# Altium schematic sheet Sheet1.SchDoc
size A0
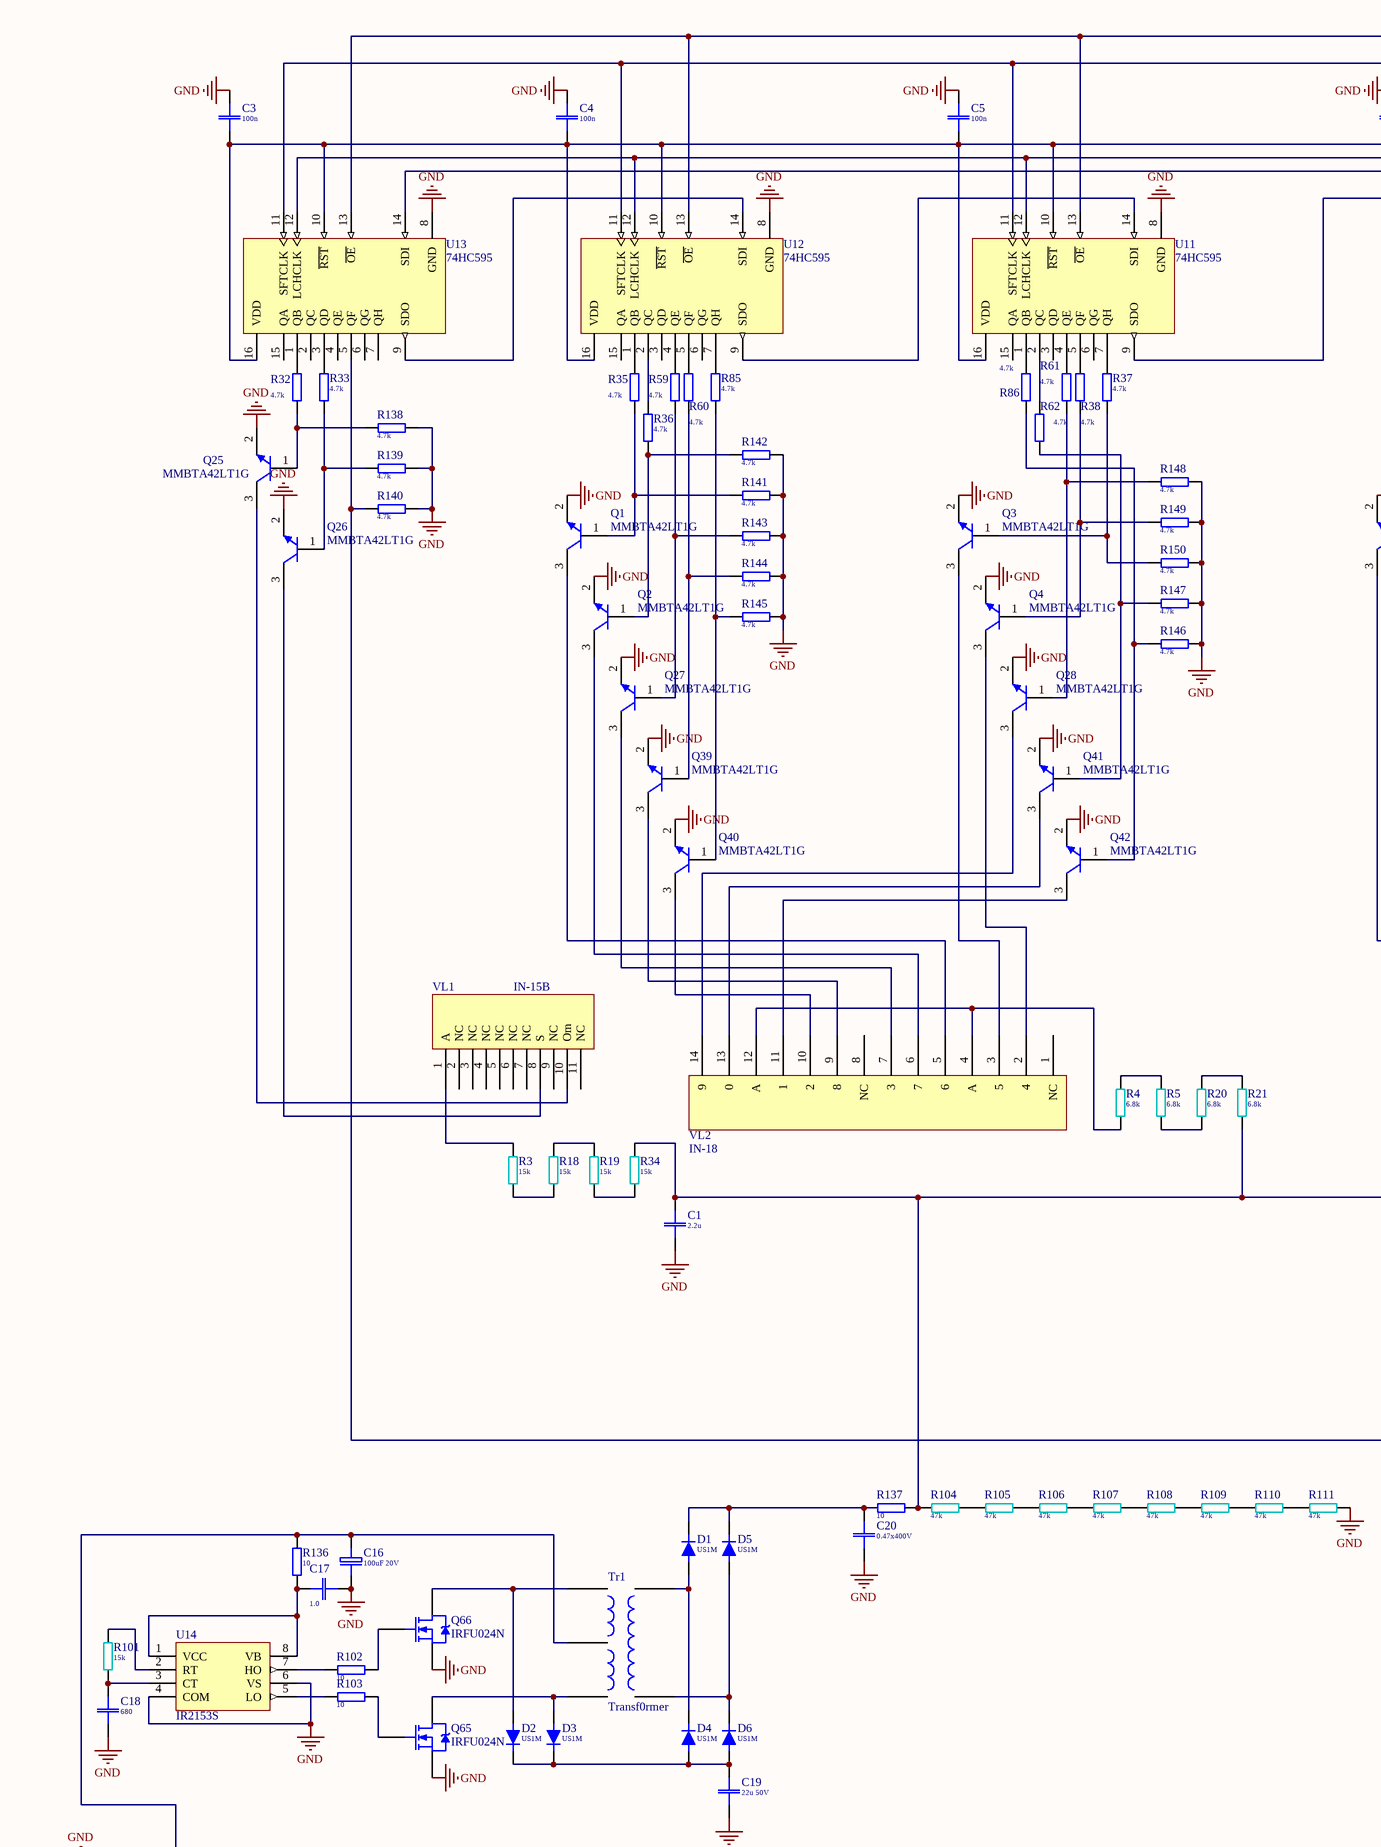
[diagram p0: Sheet1.SchDoc, top left]
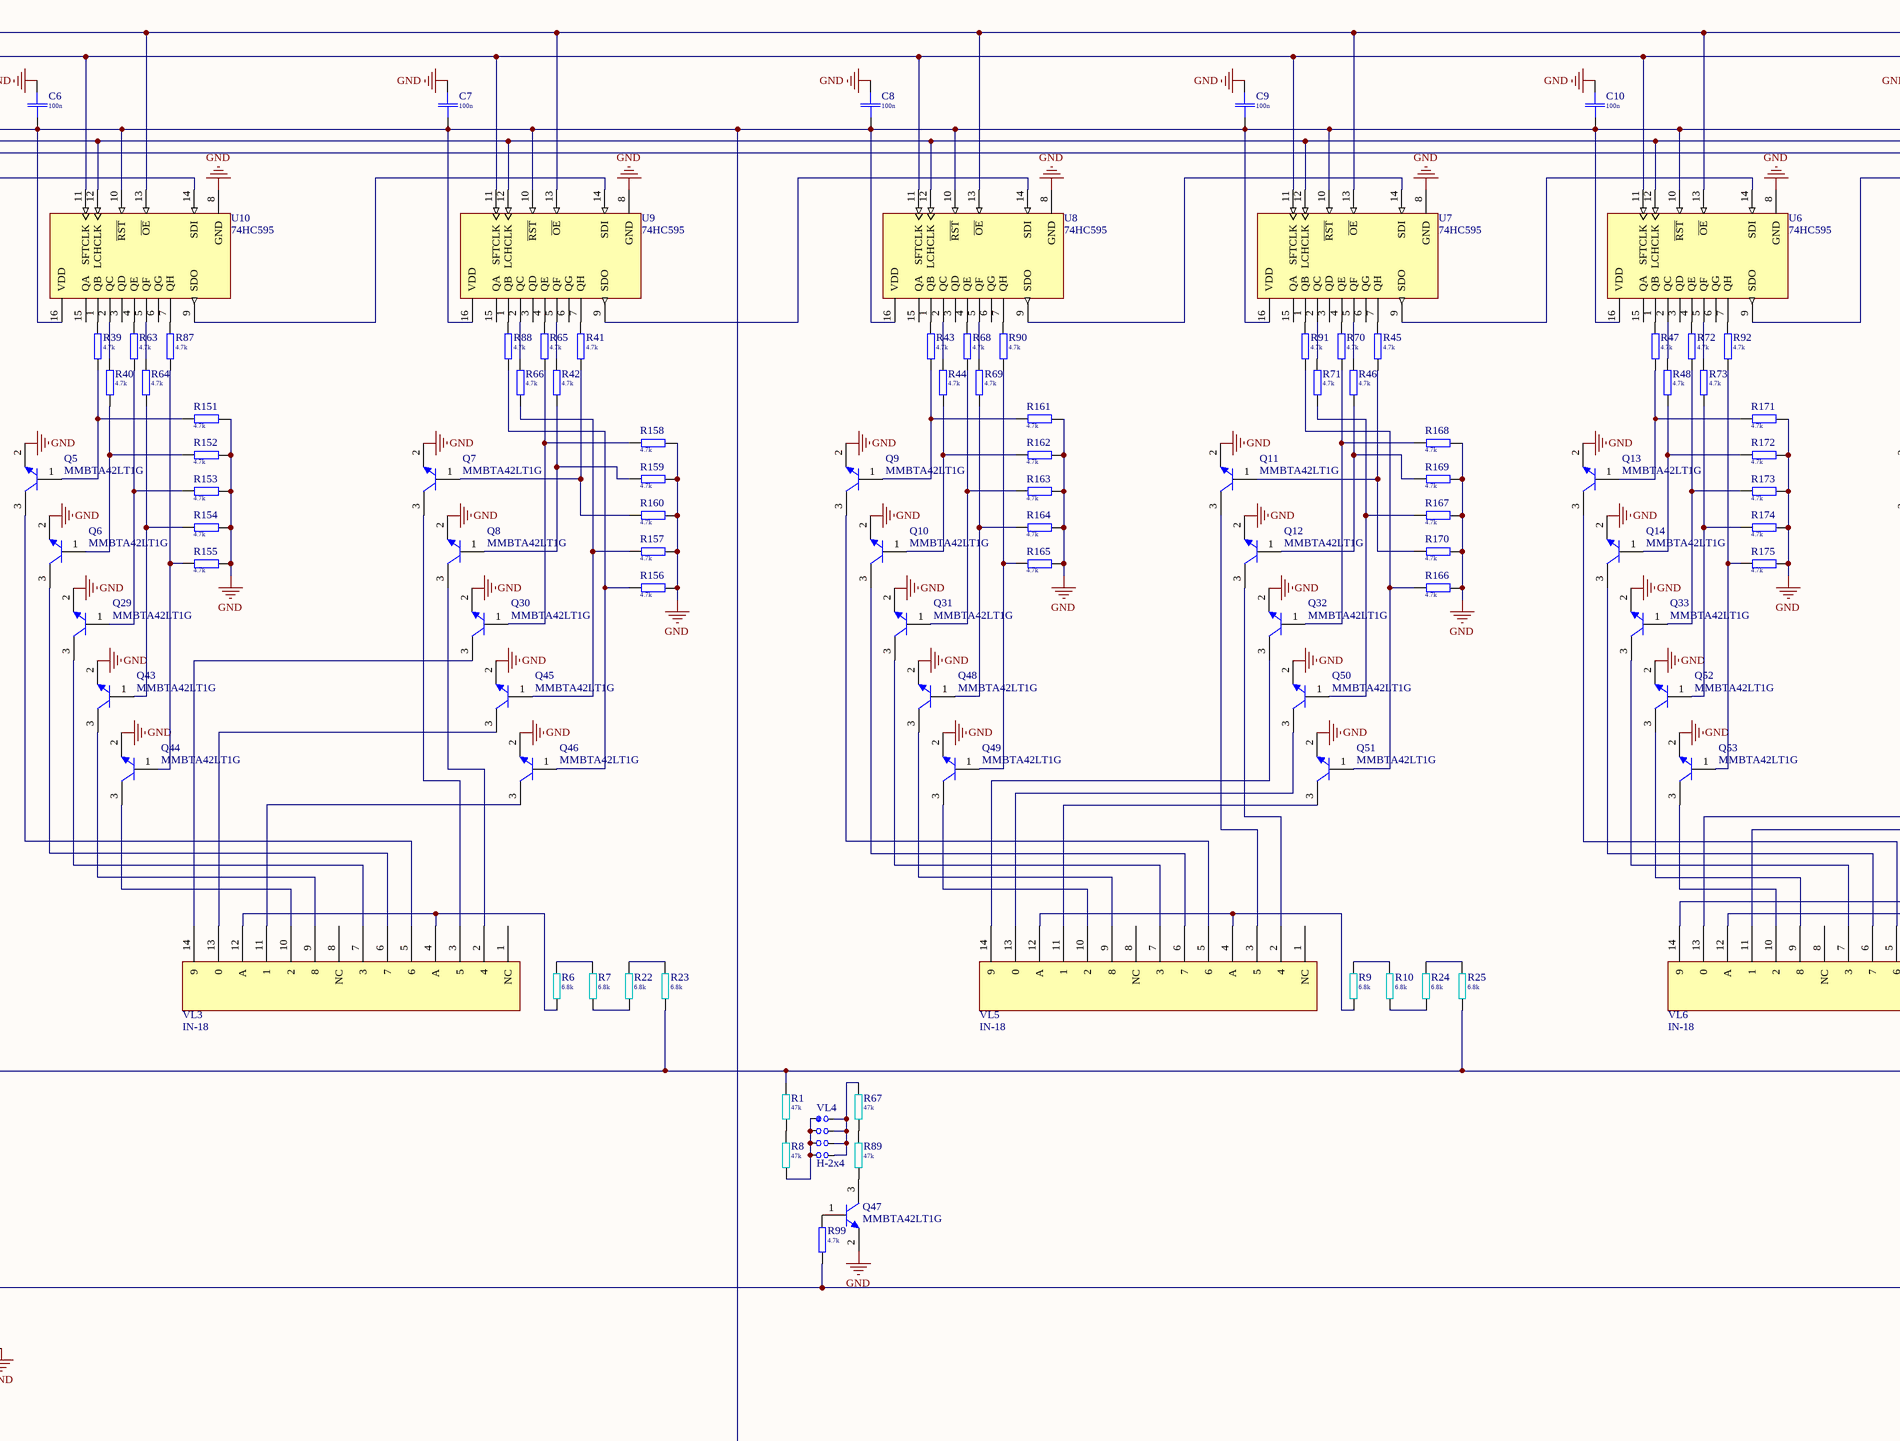
[diagram p1: Sheet1.SchDoc, top middle]
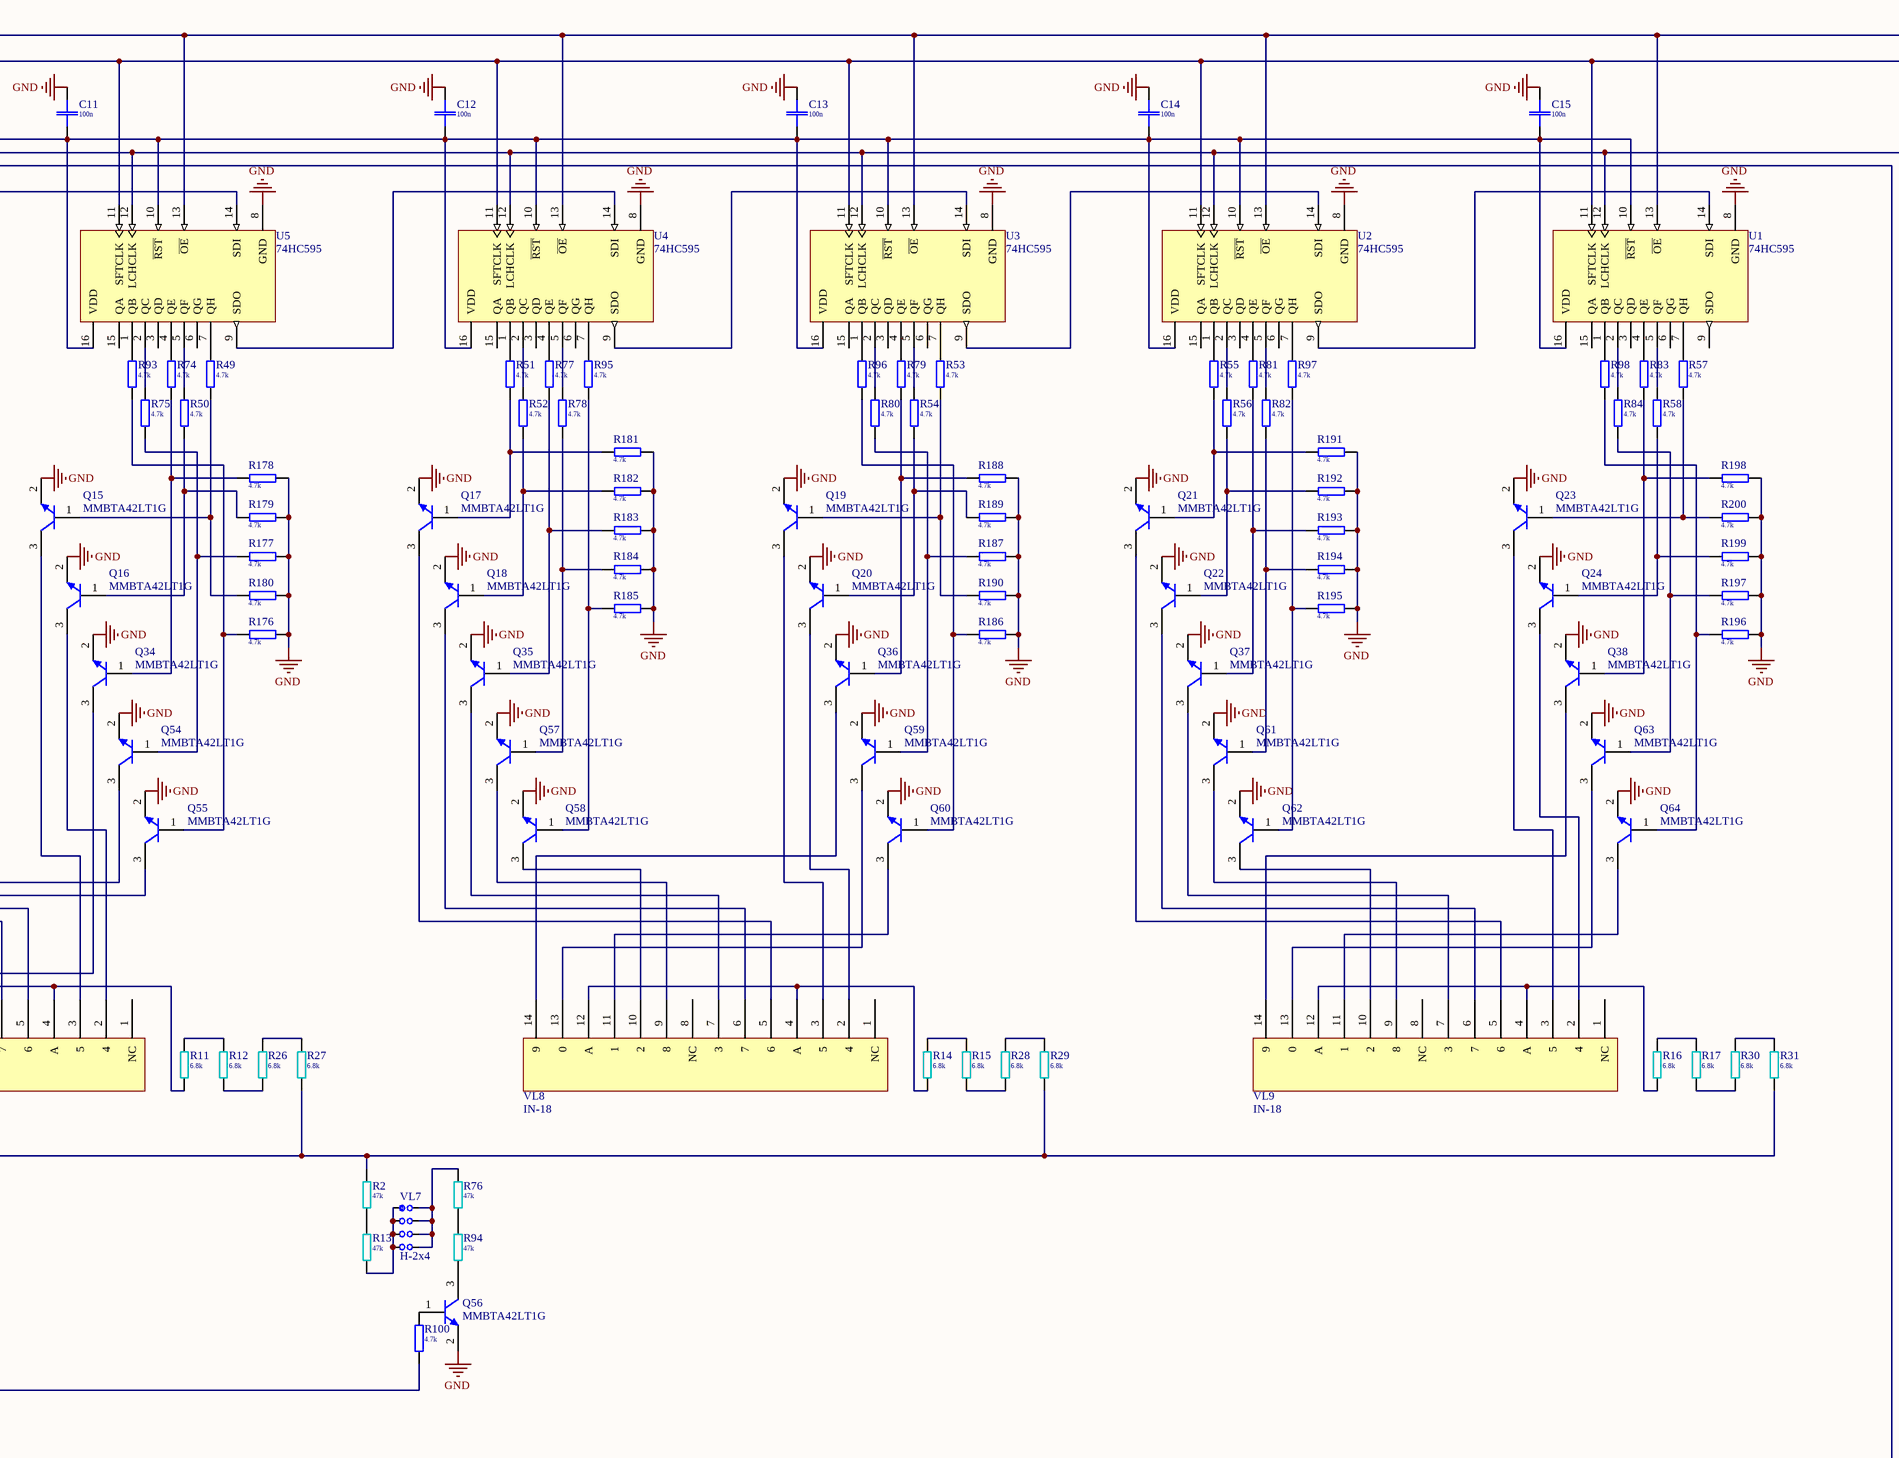
[diagram p2: Sheet1.SchDoc, top right]
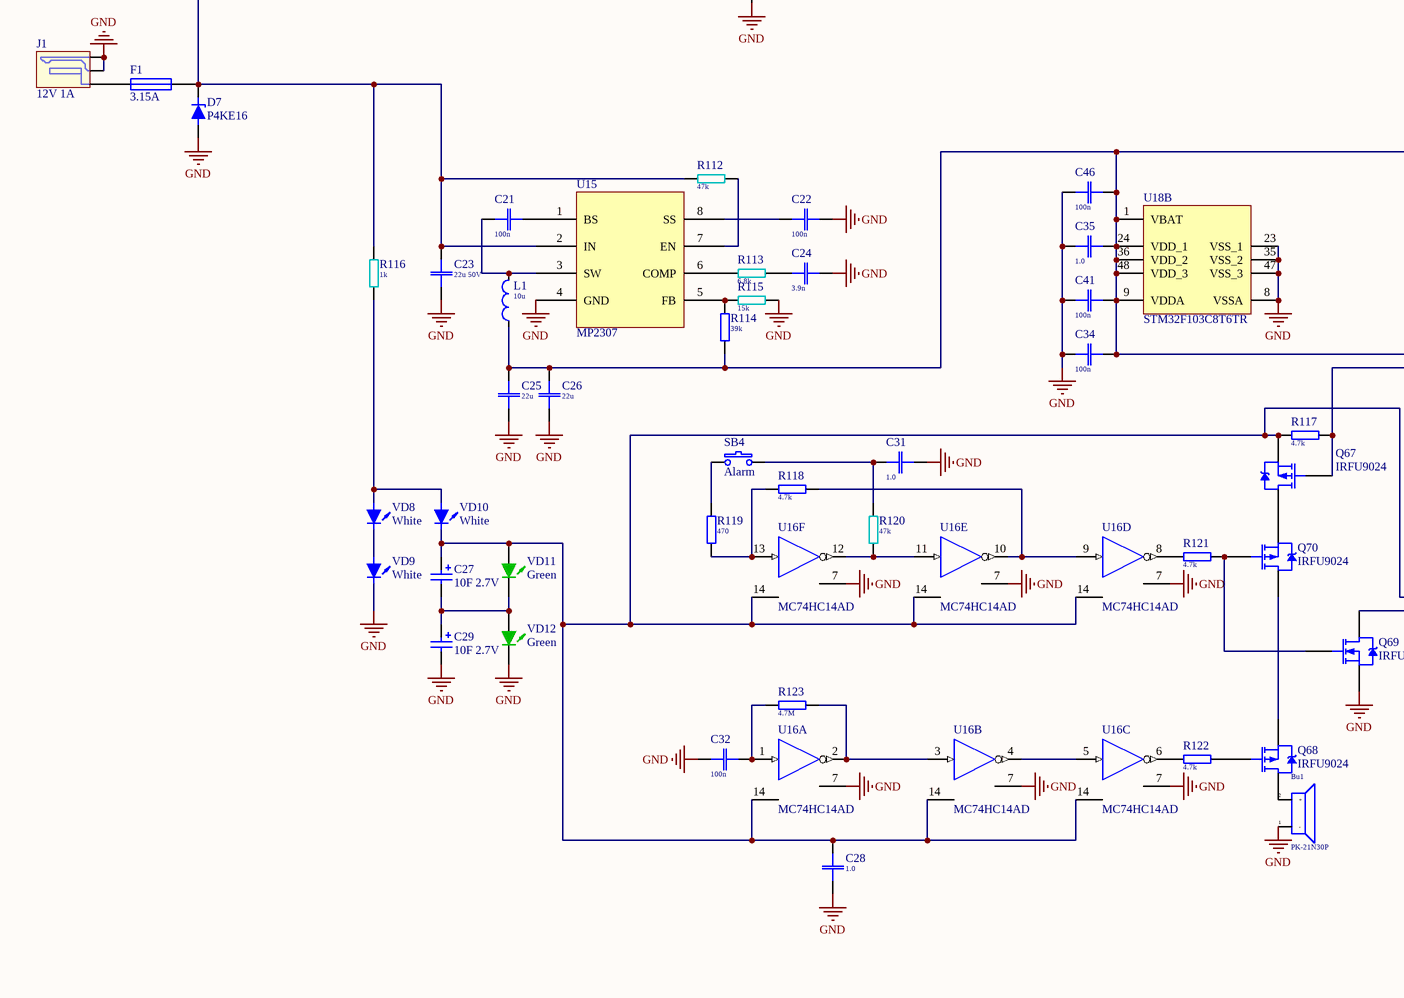
[diagram p3: Sheet1.SchDoc, bottom left]
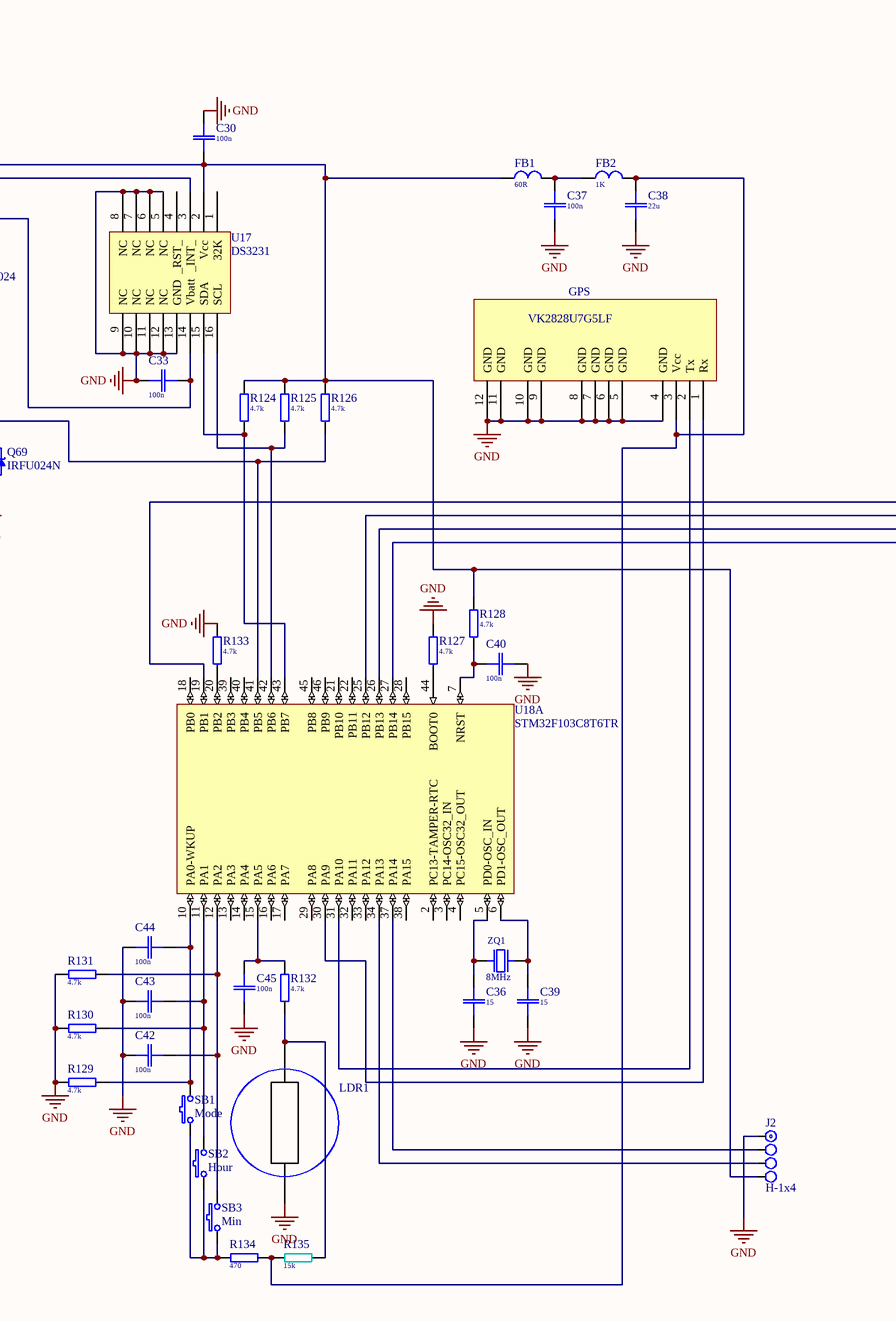
[diagram p4: Sheet1.SchDoc, bottom middle]

## Parts
Bu1  PK-21N30P  [Buzzer]
C1  2.2u  [CBB22]
C3  100n  [C0805(2013)]
C4  100n  [C0805(2013)]
C5  100n  [C0805(2013)]
C6  100n  [C0805(2013)]
C7  100n  [C0805(2013)]
C8  100n  [C0805(2013)]
C9  100n  [C0805(2013)]
C10  100n  [C0805(2013)]
C11  100n  [C0805(2013)]
C12  100n  [C0805(2013)]
C13  100n  [C0805(2013)]
C14  100n  [C0805(2013)]
C15  100n  [C0805(2013)]
C16  100uF 20V  [100.0x20V pol]
C17  1.0  [C0805(2013)]
C18  680  [C0805(2013)]
C19  22u 50V  [C1210(3225)]
C20  value 0.47x400V  [MKP 18x7 h14 R15.24]  (hidden comment: 3,3u)
C21  100n  [C0805(2013)]
C22  100n  [C0805(2013)]
C23  22u 50V  [C1210(3225)]
C24  3.9n  [C0805(2013)]
C25  22u  [C1210(3225)]
C26  22u  [C1210(3225)]
C27  value 10F 2.7V  [10F2.7V]  (hidden comment: Cap Pol2)
C28  1.0  [C0805(2013)]
C29  value 10F 2.7V  [10F2.7V]  (hidden comment: Cap Pol2)
C30  100n  [C0805(2013)]
C31  1.0  [C0805(2013)]
C32  100n  [C0805(2013)]
C33  100n  [C0805(2013)]
C34  100n  [C0805(2013)]
C35  1.0  [C0805(2013)]
C36  15  [C0805(2013)]
C37  100n  [C0805(2013)]
C38  22u  [C1210(3225)]
C39  15  [C0805(2013)]
C40  100n  [C0805(2013)]
C41  100n  [C0805(2013)]
C42  100n  [C0805(2013)]
C43  100n  [C0805(2013)]
C44  100n  [C0805(2013)]
C45  100n  [C0805(2013)]
C46  100n  [C0805(2013)]
D1  US1M  [DO-214AC (SMA)]
D2  US1M  [DO-214AC (SMA)]
D3  US1M  [DO-214AC (SMA)]
D4  US1M  [DO-214AC (SMA)]
D5  US1M  [DO-214AC (SMA)]
D6  US1M  [DO-214AC (SMA)]
D7  P4KE16  [DO-15-400]
F1  3.15A  [PIN-W2/E2.8]
FB1  60R  [C1206]
FB2  1K  [C1206]
GPS  VK2828U7G5LF  [GPSmodule]
J1  12V 1A  [Power-Jack]
J2  H-1x4  [J1x4]
L1  10u  [Dr-SD-75]
LDR1  LDR  [CAPPR250-630X1120]  (value not drawn)
Q1  MMBTA42LT1G  [ONSC-SOT-23-3-318-08_V]
Q2  MMBTA42LT1G  [ONSC-SOT-23-3-318-08_V]
Q3  MMBTA42LT1G  [ONSC-SOT-23-3-318-08_V]
Q4  MMBTA42LT1G  [ONSC-SOT-23-3-318-08_V]
Q5  MMBTA42LT1G  [ONSC-SOT-23-3-318-08_V]
Q6  MMBTA42LT1G  [ONSC-SOT-23-3-318-08_V]
Q7  MMBTA42LT1G  [ONSC-SOT-23-3-318-08_V]
Q8  MMBTA42LT1G  [ONSC-SOT-23-3-318-08_V]
Q9  MMBTA42LT1G  [ONSC-SOT-23-3-318-08_V]
Q10  MMBTA42LT1G  [ONSC-SOT-23-3-318-08_V]
Q11  MMBTA42LT1G  [ONSC-SOT-23-3-318-08_V]
Q12  MMBTA42LT1G  [ONSC-SOT-23-3-318-08_V]
Q13  MMBTA42LT1G  [ONSC-SOT-23-3-318-08_V]
Q14  MMBTA42LT1G  [ONSC-SOT-23-3-318-08_V]
Q15  MMBTA42LT1G  [ONSC-SOT-23-3-318-08_V]
Q16  MMBTA42LT1G  [ONSC-SOT-23-3-318-08_V]
Q17  MMBTA42LT1G  [ONSC-SOT-23-3-318-08_V]
Q18  MMBTA42LT1G  [ONSC-SOT-23-3-318-08_V]
Q19  MMBTA42LT1G  [ONSC-SOT-23-3-318-08_V]
Q20  MMBTA42LT1G  [ONSC-SOT-23-3-318-08_V]
Q21  MMBTA42LT1G  [ONSC-SOT-23-3-318-08_V]
Q22  MMBTA42LT1G  [ONSC-SOT-23-3-318-08_V]
Q23  MMBTA42LT1G  [ONSC-SOT-23-3-318-08_V]
Q24  MMBTA42LT1G  [ONSC-SOT-23-3-318-08_V]
Q25  MMBTA42LT1G  [ONSC-SOT-23-3-318-08_V]
Q26  MMBTA42LT1G  [ONSC-SOT-23-3-318-08_V]
Q27  MMBTA42LT1G  [ONSC-SOT-23-3-318-08_V]
Q28  MMBTA42LT1G  [ONSC-SOT-23-3-318-08_V]
Q29  MMBTA42LT1G  [ONSC-SOT-23-3-318-08_V]
Q30  MMBTA42LT1G  [ONSC-SOT-23-3-318-08_V]
Q31  MMBTA42LT1G  [ONSC-SOT-23-3-318-08_V]
Q32  MMBTA42LT1G  [ONSC-SOT-23-3-318-08_V]
Q33  MMBTA42LT1G  [ONSC-SOT-23-3-318-08_V]
Q34  MMBTA42LT1G  [ONSC-SOT-23-3-318-08_V]
Q35  MMBTA42LT1G  [ONSC-SOT-23-3-318-08_V]
Q36  MMBTA42LT1G  [ONSC-SOT-23-3-318-08_V]
Q37  MMBTA42LT1G  [ONSC-SOT-23-3-318-08_V]
Q38  MMBTA42LT1G  [ONSC-SOT-23-3-318-08_V]
Q39  MMBTA42LT1G  [ONSC-SOT-23-3-318-08_V]
Q40  MMBTA42LT1G  [ONSC-SOT-23-3-318-08_V]
Q41  MMBTA42LT1G  [ONSC-SOT-23-3-318-08_V]
Q42  MMBTA42LT1G  [ONSC-SOT-23-3-318-08_V]
Q43  MMBTA42LT1G  [ONSC-SOT-23-3-318-08_V]
Q44  MMBTA42LT1G  [ONSC-SOT-23-3-318-08_V]
Q45  MMBTA42LT1G  [ONSC-SOT-23-3-318-08_V]
Q46  MMBTA42LT1G  [ONSC-SOT-23-3-318-08_V]
Q47  MMBTA42LT1G  [ONSC-SOT-23-3-318-08_V]
Q48  MMBTA42LT1G  [ONSC-SOT-23-3-318-08_V]
Q49  MMBTA42LT1G  [ONSC-SOT-23-3-318-08_V]
Q50  MMBTA42LT1G  [ONSC-SOT-23-3-318-08_V]
Q51  MMBTA42LT1G  [ONSC-SOT-23-3-318-08_V]
Q52  MMBTA42LT1G  [ONSC-SOT-23-3-318-08_V]
Q53  MMBTA42LT1G  [ONSC-SOT-23-3-318-08_V]
Q54  MMBTA42LT1G  [ONSC-SOT-23-3-318-08_V]
Q55  MMBTA42LT1G  [ONSC-SOT-23-3-318-08_V]
Q56  MMBTA42LT1G  [ONSC-SOT-23-3-318-08_V]
Q57  MMBTA42LT1G  [ONSC-SOT-23-3-318-08_V]
Q58  MMBTA42LT1G  [ONSC-SOT-23-3-318-08_V]
Q59  MMBTA42LT1G  [ONSC-SOT-23-3-318-08_V]
Q60  MMBTA42LT1G  [ONSC-SOT-23-3-318-08_V]
Q61  MMBTA42LT1G  [ONSC-SOT-23-3-318-08_V]
Q62  MMBTA42LT1G  [ONSC-SOT-23-3-318-08_V]
Q63  MMBTA42LT1G  [ONSC-SOT-23-3-318-08_V]
Q64  MMBTA42LT1G  [ONSC-SOT-23-3-318-08_V]
Q65  IRFU024N  [TO-251AA]
Q66  IRFU024N  [TO-251AA]
Q67  IRFU9024  [TO-251AA]
Q68  IRFU9024  [TO-251AA]
Q69  IRFU024N  [TO-251AA]
Q70  IRFU9024  [TO-251AA]
R1  47k  [R1206]
R2  47k  [R1206]
R3  15k  [R1206]
R4  6.8k  [R1206]
R5  6.8k  [R1206]
R6  6.8k  [R1206]
R7  6.8k  [R1206]
R8  47k  [R1206]
R9  6.8k  [R1206]
R10  6.8k  [R1206]
R11  6.8k  [R1206]
R12  6.8k  [R1206]
R13  47k  [R1206]
R14  6.8k  [R1206]
R15  6.8k  [R1206]
R16  6.8k  [R1206]
R17  6.8k  [R1206]
R18  15k  [R1206]
R19  15k  [R1206]
R20  6.8k  [R1206]
R21  6.8k  [R1206]
R22  6.8k  [R1206]
R23  6.8k  [R1206]
R24  6.8k  [R1206]
R25  6.8k  [R1206]
R26  6.8k  [R1206]
R27  6.8k  [R1206]
R28  6.8k  [R1206]
R29  6.8k  [R1206]
R30  6.8k  [R1206]
R31  6.8k  [R1206]
R32  4.7k  [R0805]
R33  4.7k  [R0805]
R34  15k  [R1206]
R35  4.7k  [R0805]
R36  4.7k  [R0805]
R37  4.7k  [R0805]
R38  4.7k  [R0805]
R39  4.7k  [R0805]
R40  4.7k  [R0805]
R41  4.7k  [R0805]
R42  4.7k  [R0805]
R43  4.7k  [R0805]
R44  4.7k  [R0805]
R45  4.7k  [R0805]
R46  4.7k  [R0805]
R47  4.7k  [R0805]
R48  4.7k  [R0805]
R49  4.7k  [R0805]
R50  4.7k  [R0805]
R51  4.7k  [R0805]
R52  4.7k  [R0805]
R53  4.7k  [R0805]
R54  4.7k  [R0805]
R55  4.7k  [R0805]
R56  4.7k  [R0805]
R57  4.7k  [R0805]
R58  4.7k  [R0805]
R59  4.7k  [R0805]
R60  4.7k  [R0805]
R61  4.7k  [R0805]
R62  4.7k  [R0805]
R63  4.7k  [R0805]
R64  4.7k  [R0805]
R65  4.7k  [R0805]
R66  4.7k  [R0805]
R67  47k  [R1206]
R68  4.7k  [R0805]
R69  4.7k  [R0805]
R70  4.7k  [R0805]
R71  4.7k  [R0805]
R72  4.7k  [R0805]
R73  4.7k  [R0805]
R74  4.7k  [R0805]
R75  4.7k  [R0805]
R76  47k  [R1206]
R77  4.7k  [R0805]
R78  4.7k  [R0805]
R79  4.7k  [R0805]
R80  4.7k  [R0805]
R81  4.7k  [R0805]
R82  4.7k  [R0805]
R83  4.7k  [R0805]
R84  4.7k  [R0805]
R85  4.7k  [R0805]
R86  4.7k  [R0805]
R87  4.7k  [R0805]
R88  4.7k  [R0805]
R89  47k  [R1206]
R90  4.7k  [R0805]
R91  4.7k  [R0805]
R92  4.7k  [R0805]
R93  4.7k  [R0805]
R94  47k  [R1206]
R95  4.7k  [R0805]
R96  4.7k  [R0805]
R97  4.7k  [R0805]
R98  4.7k  [R0805]
R99  4.7k  [R0805]
R100  4.7k  [R0805]
R101  15k  [R1206]
R102  10  [R0805]
R103  10  [R0805]
R104  47k  [R1206]
R105  47k  [R1206]
R106  47k  [R1206]
R107  47k  [R1206]
R108  47k  [R1206]
R109  47k  [R1206]
R110  47k  [R1206]
R111  47k  [R1206]
R112  47k  [R1206]
R113  6.8k  [R1206]
R114  39k  [R0805]
R115  15k  [R1206]
R116  1k  [R1206]
R117  4.7k  [R0805]
R118  4.7k  [R0805]
R119  470  [R0805]
R120  47k  [R1206]
R121  4.7k  [R0805]
R122  4.7k  [R0805]
R123  4.7M  [R0805]
R124  4.7k  [R0805]
R125  4.7k  [R0805]
R126  4.7k  [R0805]
R127  4.7k  [R0805]
R128  4.7k  [R0805]
R129  4.7k  [R0805]
R130  4.7k  [R0805]
R131  4.7k  [R0805]
R132  4.7k  [R0805]
R133  4.7k  [R0805]
R134  470  [R0805]
R135  15k  [R1206]
R136  10  [R0805]
R137  10  [R0805]
R138  4.7k  [R0805]
R139  4.7k  [R0805]
R140  4.7k  [R0805]
R141  4.7k  [R0805]
R142  4.7k  [R0805]
R143  4.7k  [R0805]
R144  4.7k  [R0805]
R145  4.7k  [R0805]
R146  4.7k  [R0805]
R147  4.7k  [R0805]
R148  4.7k  [R0805]
R149  4.7k  [R0805]
R150  4.7k  [R0805]
R151  4.7k  [R0805]
R152  4.7k  [R0805]
R153  4.7k  [R0805]
R154  4.7k  [R0805]
R155  4.7k  [R0805]
R156  4.7k  [R0805]
R157  4.7k  [R0805]
R158  4.7k  [R0805]
R159  4.7k  [R0805]
R160  4.7k  [R0805]
R161  4.7k  [R0805]
R162  4.7k  [R0805]
R163  4.7k  [R0805]
R164  4.7k  [R0805]
R165  4.7k  [R0805]
R166  4.7k  [R0805]
R167  4.7k  [R0805]
R168  4.7k  [R0805]
R169  4.7k  [R0805]
R170  4.7k  [R0805]
R171  4.7k  [R0805]
R172  4.7k  [R0805]
R173  4.7k  [R0805]
R174  4.7k  [R0805]
R175  4.7k  [R0805]
R176  4.7k  [R0805]
R177  4.7k  [R0805]
R178  4.7k  [R0805]
R179  4.7k  [R0805]
R180  4.7k  [R0805]
R181  4.7k  [R0805]
R182  4.7k  [R0805]
R183  4.7k  [R0805]
R184  4.7k  [R0805]
R185  4.7k  [R0805]
R186  4.7k  [R0805]
R187  4.7k  [R0805]
R188  4.7k  [R0805]
R189  4.7k  [R0805]
R190  4.7k  [R0805]
R191  4.7k  [R0805]
R192  4.7k  [R0805]
R193  4.7k  [R0805]
R194  4.7k  [R0805]
R195  4.7k  [R0805]
R196  4.7k  [R0805]
R197  4.7k  [R0805]
R198  4.7k  [R0805]
R199  4.7k  [R0805]
R200  4.7k  [R0805]
SB1  Mode  [TS-06]
SB2  Hour  [TS-06]
SB3  Min  [TS-06]
SB4  Alarm  [TS-06]
Tr1  Transf0rmer  [PCBComponent_1 - duplicate1]
U1  74HC595  [SO-16_N]
U2  74HC595  [SO-16_N]
U3  74HC595  [SO-16_N]
U4  74HC595  [SO-16_N]
U5  74HC595  [SO-16_N]
U6  74HC595  [SO-16_N]
U7  74HC595  [SO-16_N]
U8  74HC595  [SO-16_N]
U9  74HC595  [SO-16_N]
U10  74HC595  [SO-16_N]
U11  74HC595  [SO-16_N]
U12  74HC595  [SO-16_N]
U13  74HC595  [SO-16_N]
U14  IR2153S  [SO-8_M]
U15  MP2307  [SO8_M]
U16  MC74HC14AD  [751A-02_N]  (parts A,B,C,D,E,F of 6)
U17  DS3231  [ADI-RW-16_M]
U18  STM32F103C8T6TR  [STM-LQFP48_N]  (parts A,B of 2)
VD8  White  [LED 3.1x1.4mm Duris E3]
VD9  White  [LED 3.1x1.4mm Duris E3]
VD10  White  [LED 3.1x1.4mm Duris E3]
VD11  Green  [C1210]
VD12  Green  [C1210]
VL1  IN-15B  [IN-12]
VL2  IN-18  [IN-18]
VL3  IN-18  [IN-18]
VL4  H-2x4  [J2x4]
VL5  IN-18  [IN-18]
VL6  IN-18  [IN-18]
VL7  H-2x4  [J2x4]
VL8  IN-18  [IN-18]
VL9  IN-18  [IN-18]
ZQ1  8MHz  [HC49S]

## Nets
GND: Bu1.1(-) C1.2 C3.1 C4.1 C5.1 C6.1 C7.1 C8.1 C9.1 C10.1 C11.1 C12.1 C13.1 C14.1 C15.1 C16.2 C17.2 C18.2 C19.2 C20.2 C22.2 C23.1 C24.2 C25.2 C26.2 C28.2 C29.2 C30.1 C31.2 C32.1 C33.1 C34.1 C35.1 C36.2 C37.2 C38.2 C39.2 C40.2 C41.1 C42.1 C43.1 C44.1 C45.2 C46.1 D7.1(A) GPS.4(GND) GPS.5(GND) GPS.6(GND) GPS.7(GND) GPS.8(GND) GPS.9(GND) GPS.10(GND) GPS.11(GND) GPS.12(GND) J1.1 J1.2 J2.1 LDR1.1 Q1.2(E) Q2.2(E) Q3.2(E) Q4.2(E) Q5.2(E) Q6.2(E) Q7.2(E) Q8.2(E) Q9.2(E) Q10.2(E) Q11.2(E) Q12.2(E) Q13.2(E) Q14.2(E) Q15.2(E) Q16.2(E) Q17.2(E) Q18.2(E) Q19.2(E) Q20.2(E) Q21.2(E) Q22.2(E) Q23.2(E) Q24.2(E) Q25.2(E) Q26.2(E) Q27.2(E) Q28.2(E) Q29.2(E) Q30.2(E) Q31.2(E) Q32.2(E) Q33.2(E) Q34.2(E) Q35.2(E) Q36.2(E) Q37.2(E) Q38.2(E) Q39.2(E) Q40.2(E) Q41.2(E) Q42.2(E) Q43.2(E) Q44.2(E) Q45.2(E) Q46.2(E) Q47.2(E) Q48.2(E) Q49.2(E) Q50.2(E) Q51.2(E) Q52.2(E) Q53.2(E) Q54.2(E) Q55.2(E) Q56.2(E) Q57.2(E) Q58.2(E) Q59.2(E) Q60.2(E) Q61.2(E) Q62.2(E) Q63.2(E) Q64.2(E) Q65.3(S) Q66.3(S) Q69.3(S) R111.1 R115.1 R127.2 R129.2 R130.2 R131.2 R133.2 R138.2 R139.1 R140.2 R141.2 R142.2 R143.2 R144.2 R145.2 R146.2 R147.2 R148.2 R149.2 R150.2 R151.2 R152.2 R153.2 R154.2 R155.2 R156.2 R157.2 R158.2 R159.2 R160.2 R161.2 R162.2 R163.2 R164.2 R165.2 R166.2 R167.2 R168.2 R169.2 R170.2 R171.2 R172.2 R173.2 R174.2 R175.2 R176.2 R177.2 R178.2 R179.2 R180.2 R181.2 R182.2 R183.2 R184.2 R185.2 R186.2 R187.2 R188.2 R189.2 R190.2 R191.2 R192.2 R193.2 R194.2 R195.2 R196.2 R197.2 R198.2 R199.2 R200.2 U1.8(GND) U2.8(GND) U3.8(GND) U4.8(GND) U5.8(GND) U6.8(GND) U7.8(GND) U8.8(GND) U9.8(GND) U10.8(GND) U11.8(GND) U12.8(GND) U13.8(GND) U14.4(COM) U14.6(VS) U15.4(GND) U16.7(GND) U17.5(NC) U17.6(NC) U17.7(NC) U17.8(NC) U17.9(NC) U17.10(NC) U17.11(NC) U17.12(NC) U17.13(GND) U18.8(VSSA) U18.23(VSS_1) U18.35(VSS_2) U18.47(VSS_3) VD9.2(K) VD12.2(K)
VDD: C27.1 C28.1 C33.2 Q67.3(S) R117.2 U16.14(VDD) U17.14(Vbatt) VD10.2(K) VD11.1(A)
NetBu1_2: Bu1.2(+) Q68.2(D)
NetC1_1: C1.1 R1.2 R2.2 R21.1 R23.1 R25.1 R27.1 R29.1 R31.1 R34.2 R104.2 R137.1
NetC3_2: C3.2 C4.2 C5.2 C6.2 C7.2 C8.2 C9.2 C10.2 C11.2 C12.2 C13.2 C14.2 C15.2 C25.1 C26.1 C30.2 C34.2 C35.2 C41.2 C46.2 FB1.1 J2.4 L1.1 R114.1 R124.2 R125.2 R126.2 R128.2 U1.10(~{RST}) U1.16(VDD) U2.10(~{RST}) U2.16(VDD) U3.10(~{RST}) U3.16(VDD) U4.10(~{RST}) U4.16(VDD) U5.10(~{RST}) U5.16(VDD) U6.10(~{RST}) U6.16(VDD) U7.10(~{RST}) U7.16(VDD) U8.10(~{RST}) U8.16(VDD) U9.10(~{RST}) U9.16(VDD) U10.10(~{RST}) U10.16(VDD) U11.10(~{RST}) U11.16(VDD) U12.10(~{RST}) U12.16(VDD) U13.10(~{RST}) U13.16(VDD) U17.2(Vcc) U18.1(VBAT) U18.9(VDDA) U18.24(VDD_1) U18.36(VDD_2) U18.48(VDD_3)
NetC16_1: C16.1 C23.2 D7.2(C) F1.2 R112.1 R116.2 R136.2 Tr1.2 U15.2(IN)
NetC17_1: C17.1 R136.1 U14.1(VCC) U14.8(VB)
NetC18_1: C18.1 R101.1 U14.3(CT)
NetC19_1: C19.1 D2.2(K) D3.2(K) D4.1(A) D6.1(A)
NetC20_1: C20.1 D1.2(K) D5.2(K) R137.2
NetC21_1: C21.1 L1.2 U15.3(SW)
NetC21_2: C21.2 U15.1(BS)
NetC22_1: C22.1 U15.8(SS)
NetC24_1: C24.1 R113.1
NetC27_2: C27.2 C29.1 VD11.2(K) VD12.1(A)
NetC31_1: C31.1 R120.2 SB4.2
NetC32_2: C32.2 R123.2 U16.1(A)
NetC36_1: C36.1 U18.5(PD0-OSC_IN) ZQ1.2
NetC37_1: C37.1 FB1.2 FB2.1
NetC38_1: C38.1 FB2.2 GPS.3(Vcc) R134.1 R135.2
NetC39_1: C39.1 U18.6(PD1-OSC_OUT) ZQ1.1
NetC40_1: C40.1 R128.1 U18.7(NRST)
NetC42_2: C42.2 R131.1 SB3.2 U18.12(PA2)
NetC43_2: C43.2 R130.1 SB2.2 U18.11(PA1)
NetC44_2: C44.2 R129.1 SB1.2 U18.10(PA0-WKUP)
NetC45_1: C45.1 R132.2 U18.15(PA5)
NetD1_1: D1.1(A) D4.2(K) Tr1.5
NetD2_1: D2.1(A) Q66.2(D) Tr1.3
NetD3_1: D3.1(A) Q65.2(D) Tr1.1
NetD5_1: D5.1(A) D6.2(K) Tr1.4
NetF1_1: F1.1 J1.3
NetGPS_1: GPS.1(Rx) U18.30(PA9)
NetGPS_2: GPS.2(Tx) U18.31(PA10)
NetJ2_2: J2.2 U18.37(PA14)
NetJ2_3: J2.3 U18.34(PA13)
NetLDR1_2: LDR1.2 R132.1 R135.1
NetQ1_1: Q1.1(B) R35.1 R141.1
NetQ1_3: Q1.3(C) VL2.5(6)
NetQ2_1: Q2.1(B) R36.1 R142.1
NetQ2_3: Q2.3(C) VL2.6(7)
NetQ3_1: Q3.1(B) R37.1 R150.1
NetQ3_3: Q3.3(C) VL2.3(5)
NetQ4_1: Q4.1(B) R38.1 R149.1
NetQ4_3: Q4.3(C) VL2.2(4)
NetQ5_1: Q5.1(B) R39.1 R151.1
NetQ5_3: Q5.3(C) VL3.5(6)
NetQ6_1: Q6.1(B) R40.1 R152.1
NetQ6_3: Q6.3(C) VL3.6(7)
NetQ7_1: Q7.1(B) R41.1 R160.1
NetQ7_3: Q7.3(C) VL3.3(5)
NetQ8_1: Q8.1(B) R42.1 R159.1
NetQ8_3: Q8.3(C) VL3.2(4)
NetQ9_1: Q9.1(B) R43.1 R161.1
NetQ9_3: Q9.3(C) VL5.5(6)
NetQ10_1: Q10.1(B) R44.1 R162.1
NetQ10_3: Q10.3(C) VL5.6(7)
NetQ11_1: Q11.1(B) R45.1 R170.1
NetQ11_3: Q11.3(C) VL5.3(5)
NetQ12_1: Q12.1(B) R46.1 R169.1
NetQ12_3: Q12.3(C) VL5.2(4)
NetQ13_1: Q13.1(B) R47.1 R171.1
NetQ13_3: Q13.3(C) VL6.5(6)
NetQ14_1: Q14.1(B) R48.1 R172.1
NetQ14_3: Q14.3(C) VL6.6(7)
NetQ15_1: Q15.1(B) R49.1 R180.1
NetQ15_3: Q15.3(C) VL6.3(5)
NetQ16_1: Q16.1(B) R50.1 R179.1
NetQ16_3: Q16.3(C) VL6.2(4)
NetQ17_1: Q17.1(B) R51.1 R181.1
NetQ17_3: Q17.3(C) VL8.5(6)
NetQ18_1: Q18.1(B) R52.1 R182.1
NetQ18_3: Q18.3(C) VL8.6(7)
NetQ19_1: Q19.1(B) R53.1 R190.1
NetQ19_3: Q19.3(C) VL8.3(5)
NetQ20_1: Q20.1(B) R54.1 R189.1
NetQ20_3: Q20.3(C) VL8.2(4)
NetQ21_1: Q21.1(B) R55.1 R191.1
NetQ21_3: Q21.3(C) VL9.5(6)
NetQ22_1: Q22.1(B) R56.1 R192.1
NetQ22_3: Q22.3(C) VL9.6(7)
NetQ23_1: Q23.1(B) R57.1 R200.1
NetQ23_3: Q23.3(C) VL9.3(5)
NetQ24_1: Q24.1(B) R58.1 R199.1
NetQ24_3: Q24.3(C) VL9.2(4)
NetQ25_1: Q25.1(B) R32.2 R138.1
NetQ25_3: Q25.3(C) VL1.10(Om)
NetQ26_1: Q26.1(B) R33.1 R139.2
NetQ26_3: Q26.3(C) VL1.8(S)
NetQ27_1: Q27.1(B) R59.1 R143.1
NetQ27_3: Q27.3(C) VL2.7(3)
NetQ28_1: Q28.1(B) R61.1 R148.1
NetQ28_3: Q28.3(C) VL2.14(9)
NetQ29_1: Q29.1(B) R63.1 R153.1
NetQ29_3: Q29.3(C) VL3.7(3)
NetQ30_1: Q30.1(B) R65.1 R158.1
NetQ30_3: Q30.3(C) VL3.14(9)
NetQ31_1: Q31.1(B) R68.1 R163.1
NetQ31_3: Q31.3(C) VL5.7(3)
NetQ32_1: Q32.1(B) R70.1 R168.1
NetQ32_3: Q32.3(C) VL5.14(9)
NetQ33_1: Q33.1(B) R72.1 R173.1
NetQ33_3: Q33.3(C) VL6.7(3)
NetQ34_1: Q34.1(B) R74.1 R178.1
NetQ34_3: Q34.3(C) VL6.14(9)
NetQ35_1: Q35.1(B) R77.1 R183.1
NetQ35_3: Q35.3(C) VL8.7(3)
NetQ36_1: Q36.1(B) R79.1 R188.1
NetQ36_3: Q36.3(C) VL8.14(9)
NetQ37_1: Q37.1(B) R81.1 R193.1
NetQ37_3: Q37.3(C) VL9.7(3)
NetQ38_1: Q38.1(B) R83.1 R198.1
NetQ38_3: Q38.3(C) VL9.14(9)
NetQ39_1: Q39.1(B) R60.1 R144.1
NetQ39_3: Q39.3(C) VL2.9(8)
NetQ40_1: Q40.1(B) R85.1 R145.1
NetQ40_3: Q40.3(C) VL2.10(2)
NetQ41_1: Q41.1(B) R62.1 R147.1
NetQ41_3: Q41.3(C) VL2.13(0)
NetQ42_1: Q42.1(B) R86.1 R146.1
NetQ42_3: Q42.3(C) VL2.11(1)
NetQ43_1: Q43.1(B) R64.1 R154.1
NetQ43_3: Q43.3(C) VL3.9(8)
NetQ44_1: Q44.1(B) R87.1 R155.1
NetQ44_3: Q44.3(C) VL3.10(2)
NetQ45_1: Q45.1(B) R66.1 R157.1
NetQ45_3: Q45.3(C) VL3.13(0)
NetQ46_1: Q46.1(B) R88.1 R156.1
NetQ46_3: Q46.3(C) VL3.11(1)
NetQ47_1: Q47.1(B) R99.2
NetQ47_3: Q47.3(C) R89.1
NetQ48_1: Q48.1(B) R69.1 R164.1
NetQ48_3: Q48.3(C) VL5.9(8)
NetQ49_1: Q49.1(B) R90.1 R165.1
NetQ49_3: Q49.3(C) VL5.10(2)
NetQ50_1: Q50.1(B) R71.1 R167.1
NetQ50_3: Q50.3(C) VL5.13(0)
NetQ51_1: Q51.1(B) R91.1 R166.1
NetQ51_3: Q51.3(C) VL5.11(1)
NetQ52_1: Q52.1(B) R73.1 R174.1
NetQ52_3: Q52.3(C) VL6.9(8)
NetQ53_1: Q53.1(B) R92.1 R175.1
NetQ53_3: Q53.3(C) VL6.10(2)
NetQ54_1: Q54.1(B) R75.1 R177.1
NetQ54_3: Q54.3(C) VL6.13(0)
NetQ55_1: Q55.1(B) R93.1 R176.1
NetQ55_3: Q55.3(C) VL6.11(1)
NetQ56_1: Q56.1(B) R100.2
NetQ56_3: Q56.3(C) R94.1
NetQ57_1: Q57.1(B) R78.1 R184.1
NetQ57_3: Q57.3(C) VL8.9(8)
NetQ58_1: Q58.1(B) R95.1 R185.1
NetQ58_3: Q58.3(C) VL8.10(2)
NetQ59_1: Q59.1(B) R80.1 R187.1
NetQ59_3: Q59.3(C) VL8.13(0)
NetQ60_1: Q60.1(B) R96.1 R186.1
NetQ60_3: Q60.3(C) VL8.11(1)
NetQ61_1: Q61.1(B) R82.1 R194.1
NetQ61_3: Q61.3(C) VL9.9(8)
NetQ62_1: Q62.1(B) R97.1 R195.1
NetQ62_3: Q62.3(C) VL9.10(2)
NetQ63_1: Q63.1(B) R84.1 R197.1
NetQ63_3: Q63.3(C) VL9.13(0)
NetQ64_1: Q64.1(B) R98.1 R196.1
NetQ64_3: Q64.3(C) VL9.11(1)
NetQ65_1: Q65.1(G) R103.1
NetQ66_1: Q66.1(G) R102.2
NetQ67_1: Q67.1(G) R117.1 U17.3(_INT_)
NetQ67_2: Q67.2(D) Q70.3(S)
NetQ68_1: Q68.1(G) R122.1
NetQ68_3: Q68.3(S) Q70.2(D)
NetQ69_1: Q69.1(G) Q70.1(G) R121.1
NetQ69_2: Q69.2(D) R126.1 U18.41(PB5)
NetR1_1: R1.1 R8.2
NetR2_1: R2.1 R13.2
NetR3_1: R3.1 R18.1
NetR3_2: R3.2 VL1.1(A)
NetR4_1: R4.1 VL2.4(A) VL2.12(A)
NetR4_2: R4.2 R5.2
NetR5_1: R5.1 R20.1
NetR6_1: R6.1 VL3.4(A) VL3.12(A)
NetR6_2: R6.2 R7.2
NetR7_1: R7.1 R22.1
NetR8_1: R8.1 VL4.1 VL4.3 VL4.5 VL4.7
NetR9_1: R9.1 VL5.4(A) VL5.12(A)
NetR9_2: R9.2 R10.2
NetR10_1: R10.1 R24.1
NetR11_1: R11.1 VL6.4(A) VL6.12(A)
NetR11_2: R11.2 R12.2
NetR12_1: R12.1 R26.1
NetR13_1: R13.1 VL7.1 VL7.3 VL7.5 VL7.7
NetR14_1: R14.1 VL8.4(A) VL8.12(A)
NetR14_2: R14.2 R15.2
NetR15_1: R15.1 R28.1
NetR16_1: R16.1 VL9.4(A) VL9.12(A)
NetR16_2: R16.2 R17.2
NetR17_1: R17.1 R30.1
NetR18_2: R18.2 R19.2
NetR19_1: R19.1 R34.1
NetR20_2: R20.2 R21.2
NetR22_2: R22.2 R23.2
NetR24_2: R24.2 R25.2
NetR26_2: R26.2 R27.2
NetR28_2: R28.2 R29.2
NetR30_2: R30.2 R31.2
NetR32_1: R32.1 U13.1(QB)
NetR33_2: R33.2 U13.3(QD)
NetR35_2: R35.2 U12.1(QB)
NetR36_2: R36.2 U12.2(QC)
NetR37_2: R37.2 U11.7(QH)
NetR38_2: R38.2 U11.5(QF)
NetR39_2: R39.2 U10.1(QB)
NetR40_2: R40.2 U10.2(QC)
NetR41_2: R41.2 U9.7(QH)
NetR42_2: R42.2 U9.5(QF)
NetR43_2: R43.2 U8.1(QB)
NetR44_2: R44.2 U8.2(QC)
NetR45_2: R45.2 U7.7(QH)
NetR46_2: R46.2 U7.5(QF)
NetR47_2: R47.2 U6.1(QB)
NetR48_2: R48.2 U6.2(QC)
NetR49_2: R49.2 U5.7(QH)
NetR50_2: R50.2 U5.5(QF)
NetR51_2: R51.2 U4.1(QB)
NetR52_2: R52.2 U4.2(QC)
NetR53_2: R53.2 U3.7(QH)
NetR54_2: R54.2 U3.5(QF)
NetR55_2: R55.2 U2.1(QB)
NetR56_2: R56.2 U2.2(QC)
NetR57_2: R57.2 U1.7(QH)
NetR58_2: R58.2 U1.5(QF)
NetR59_2: R59.2 U12.4(QE)
NetR60_2: R60.2 U12.5(QF)
NetR61_2: R61.2 U11.4(QE)
NetR62_2: R62.2 U11.2(QC)
NetR63_2: R63.2 U10.4(QE)
NetR64_2: R64.2 U10.5(QF)
NetR65_2: R65.2 U9.4(QE)
NetR66_2: R66.2 U9.2(QC)
NetR67_1: R67.1 R89.2
NetR67_2: R67.2 VL4.2 VL4.4 VL4.6 VL4.8
NetR68_2: R68.2 U8.4(QE)
NetR69_2: R69.2 U8.5(QF)
NetR70_2: R70.2 U7.4(QE)
NetR71_2: R71.2 U7.2(QC)
NetR72_2: R72.2 U6.4(QE)
NetR73_2: R73.2 U6.5(QF)
NetR74_2: R74.2 U5.4(QE)
NetR75_2: R75.2 U5.2(QC)
NetR76_1: R76.1 R94.2
NetR76_2: R76.2 VL7.2 VL7.4 VL7.6 VL7.8
NetR77_2: R77.2 U4.4(QE)
NetR78_2: R78.2 U4.5(QF)
NetR79_2: R79.2 U3.4(QE)
NetR80_2: R80.2 U3.2(QC)
NetR81_2: R81.2 U2.4(QE)
NetR82_2: R82.2 U2.5(QF)
NetR83_2: R83.2 U1.4(QE)
NetR84_2: R84.2 U1.2(QC)
NetR85_2: R85.2 U12.7(QH)
NetR86_2: R86.2 U11.1(QB)
NetR87_2: R87.2 U10.7(QH)
NetR88_2: R88.2 U9.1(QB)
NetR90_2: R90.2 U8.7(QH)
NetR91_2: R91.2 U7.1(QB)
NetR92_2: R92.2 U6.7(QH)
NetR93_2: R93.2 U5.1(QB)
NetR95_2: R95.2 U4.7(QH)
NetR96_2: R96.2 U3.1(QB)
NetR97_2: R97.2 U2.7(QH)
NetR98_2: R98.2 U1.1(QB)
NetR99_1: R99.1 R100.1 R140.1 U13.5(QF)
NetR101_2: R101.2 U14.2(RT)
NetR102_1: R102.1 U14.7(HO)
NetR103_2: R103.2 U14.5(LO)
NetR104_1: R104.1 R105.2
NetR105_1: R105.1 R106.2
NetR106_1: R106.1 R107.2
NetR107_1: R107.1 R108.2
NetR108_1: R108.1 R109.2
NetR109_1: R109.1 R110.2
NetR110_1: R110.1 R111.2
NetR112_2: R112.2 U15.7(EN)
NetR113_2: R113.2 U15.6(COMP)
NetR114_2: R114.2 R115.2 U15.5(FB)
NetR116_1: R116.1 VD8.1(A) VD10.1(A)
NetR118_1: R118.1 U16.9(A) U16.10(Y)
NetR118_2: R118.2 R119.1 U16.13(A)
NetR119_2: R119.2 SB4.1
NetR120_1: R120.1 U16.11(A) U16.12(Y)
NetR121_2: R121.2 U16.8(Y)
NetR122_2: R122.2 U16.6(Y)
NetR123_1: R123.1 U16.2(Y) U16.3(A)
NetR124_1: R124.1 U17.15(SDA) U18.43(PB7)
NetR125_1: R125.1 U17.16(SCL) U18.42(PB6)
NetR127_1: R127.1 U18.44(BOOT0)
NetR133_1: R133.1 U18.20(PB2)
NetR134_2: R134.2 SB1.1 SB2.1 SB3.1
NetU1_11: U1.11(SFTCLK) U2.11(SFTCLK) U3.11(SFTCLK) U4.11(SFTCLK) U5.11(SFTCLK) U6.11(SFTCLK) U7.11(SFTCLK) U8.11(SFTCLK) U9.11(SFTCLK) U10.11(SFTCLK) U11.11(SFTCLK) U12.11(SFTCLK) U13.11(SFTCLK) U18.25(PB12)
NetU1_12: U1.12(LCHCLK) U2.12(LCHCLK) U3.12(LCHCLK) U4.12(LCHCLK) U5.12(LCHCLK) U6.12(LCHCLK) U7.12(LCHCLK) U8.12(LCHCLK) U9.12(LCHCLK) U10.12(LCHCLK) U11.12(LCHCLK) U12.12(LCHCLK) U13.12(LCHCLK) U18.26(PB13)
NetU1_13: U1.13(~{OE}) U2.13(~{OE}) U3.13(~{OE}) U4.13(~{OE}) U5.13(~{OE}) U6.13(~{OE}) U7.13(~{OE}) U8.13(~{OE}) U9.13(~{OE}) U10.13(~{OE}) U11.13(~{OE}) U12.13(~{OE}) U13.13(~{OE}) U18.19(PB1)
NetU1_14: U1.14(SDI) U2.9(SDO)
NetU2_14: U2.14(SDI) U3.9(SDO)
NetU3_14: U3.14(SDI) U4.9(SDO)
NetU4_14: U4.14(SDI) U5.9(SDO)
NetU5_14: U5.14(SDI) U6.9(SDO)
NetU6_14: U6.14(SDI) U7.9(SDO)
NetU7_14: U7.14(SDI) U8.9(SDO)
NetU8_14: U8.14(SDI) U9.9(SDO)
NetU9_14: U9.14(SDI) U10.9(SDO)
NetU10_14: U10.14(SDI) U11.9(SDO)
NetU11_14: U11.14(SDI) U12.9(SDO)
NetU12_14: U12.14(SDI) U13.9(SDO)
NetU13_14: U13.14(SDI) U18.27(PB14)
NetU16_4: U16.4(Y) U16.5(A)
NetVD8_2: VD8.2(K) VD9.1(A)

Not connected (* = marked no-connect by the designer): U1 3(QD) 6(QG) 9(SDO) 15(QA); U2 3(QD) 6(QG) 15(QA); U3 3(QD) 6(QG) 15(QA); U4 3(QD) 6(QG) 15(QA); U5 3(QD) 6(QG) 15(QA); U6 3(QD) 6(QG) 15(QA); U7 3(QD) 6(QG) 15(QA); U8 3(QD) 6(QG) 15(QA); U9 3(QD) 6(QG) 15(QA); U10 3(QD) 6(QG) 15(QA); U11 3(QD) 6(QG) 15(QA); U12 3(QD) 6(QG) 15(QA); U13 2(QC) 4(QE) 6(QG) 7(QH) 15(QA); U17 1(32K) 4(_RST_); U18 2(PC13-TAMPER-RTC) 3(PC14-OSC32_IN) 4(PC15-OSC32_OUT) 13(PA3) 14(PA4) 16(PA6) 17(PA7) 18(PB0) 21(PB10) 22(PB11) 28(PB15) 29(PA8) 32(PA11) 33(PA12) 38(PA15) 39(PB3) 40(PB4) 45(PB8) 46(PB9); VL1 2(NC) 3(NC) 4(NC) 5(NC) 6(NC) 7(NC) 9(NC) 11(NC); VL2 1(NC) 8(NC); VL3 1(NC) 8(NC); VL5 1(NC) 8(NC); VL6 1(NC) 8(NC); VL8 1(NC) 8(NC); VL9 1(NC) 8(NC)

## Library data of the parts
Bu1 = Buz PK-21N30P: Price: 1.7
C1 = MER 1uF 250V: VALUE: 2.2u
C3-C15 C17 C18 C21 C22 C24 C28 C30-C37 C39-C46 = C-0805: SMD-0805; Price: 0.014
  C3-C15 C21 C22 C30 C32-C34 C37 C40-C46: Value: 100n
  C17 C28 C31 C35: Value: 1.0
  C18: Value: 680
  C24: Value: 3.9n
  C36 C39: Value: 15
C16 = 1u-400V-105F: 400V 105F; pin to pad: 1>2 2>1; Price: 0.09; Value: 100uF 20V
C19 C23 C25 C26 C38 = C-1210  100V 2.2u: SMD-1210 100V X7R 10%; Price: 1
  C19 C23: Value: 22u 50V
  C25 C26 C38: Value: 22u
C20 = MKS4 3.3u 63V: Tip: MKS4 3.3uF 63V 10%; Price: 2
C27 C29 = Cap Pol2: Polarized Capacitor (Axial); pin to pad: 1>2 2>1; Published: 8-Jun-2000; LatestRevisionDate: 17-Jul-2002; LatestRevisionNote: Re-released for DXP Platform.; PackageReference: POLAR0.8; Publisher: Altium Limited; PackageDescription: Polarized Capacitor; 2 Leads
D1-D6 = US1M: SMD SMA 1A 1000V 75nS; Price: 0.06
D7 = P6KE200: TVS DO-15 600W 200V; Price: 0.29
F1 = Fuse 1: Fuse; Published: 8-Jun-2000; LatestRevisionDate: 17-Jul-2002; LatestRevisionNote: Re-released for DXP Platform.; PackageReference: PIN-W2/E2.8; Publisher: Altium Limited; PackageDescription: Thru-Hole; 2 Leads
FB1 FB2 = L2: Price: 0.2
  FB1: Value: 60R
  FB2: Value: 1K
GPS = GPS_ant: Amt02 GPS antenna
J1 = Power-Jack
L1 = L-SD-75 33uH: 1.2A 0.15om 7.3x7.3x5mm; Price: 0.85; Value: 10u
Q1-Q64 = MMBTA42LT1G: High Voltage Transistor, NPN Silicon, 3-Pin SOT-23, Pb-Free, Tape and Reel; Manufacturer: On Semiconductor; fT Min (MHz): 50; IC Continuous (A): 0.5; DatasheetVersion: Rev. 12; PackageVersion: Rev. AP, 11/2009; PackageReference: SOT-23-3-318-08; PackageDescription: 3-Pin Small Outline Transistor, Body 2.92 x 1.3 mm, Pitch 0.95 mm; Supplier 1: Digi-Key; Supplier Part Number 1: MMBTA42LT1GOSTR-ND; Supplier 2: Digi-Key; Supplier Part Number 2: MMBTA42LT1GOSCT-ND; Supplier 3: Digi-Key; Supplier Part Number 3: MMBTA42LT1GOSDKR-ND; Supplier 4: Farnell; Supplier Part Number 4: 2317845; Supplier 5: Farnell; Supplier Part Number 5: 1459111RL; Supplier 6: Farnell; Supplier Part Number 6: 1459111; Supplier 7: Newark; Supplier Part Number 7: 88H4783; Supplier 8: Newark; Supplier Part Number 8: 67R1332; Supplier 9: Mouser; Supplier Part Number 9: 863-MMBTA42LT1G; Packing: Tape and Reel; Polarity: NPN; RoHS: TRUE; Mounting Technology: Surface Mount; PartNumber: MMBTA42LT1G; ComponentLink1Description: Manufacturer URL; ComponentLink1URL: http://www.onsemi.com/; ComponentLink2Description: Datasheet; ComponentLink2URL: http://www.onsemi.cn/pub_link/Collateral/MMBTA42LT1-D.PDF; ComponentLink3Description: Package Specification; ComponentLink3URL: http://www.onsemi.cn/pub_link/Collateral/318-08.PDF
Q65 Q66 Q69 = IRFU024N: HEXFET Power MOSFET; Note: Pin 2 is electrically connected to pin 4.; Published: 8-Jun-2000; LatestRevisionDate: 17-Jul-2002; LatestRevisionNote: Re-released for DXP Platform.; DatasheetVersion: Apr-1998; PackageReference: TO-251AA; Publisher: Altium Limited; PackageDescription: TO, Thru-Hole, Vertical, Heatsink Mounted; 3 In-Line Leads; Pitch 2.28 mm; ComponentLink1Description: Manufacturer Link; ComponentLink1URL: http://www.irf.com/; ComponentLink2Description: Datasheet; ComponentLink2URL: http://www.irf.com/product-info/datasheets/data/irfr024n.pdf
Q67 Q68 Q70 = IRFU9024: HEXFET Power MOSFET; Note: Pin 2 is electrically connected to pin 4.; Published: 8-Jun-2000; LatestRevisionDate: 17-Jul-2002; LatestRevisionNote: Re-released for DXP Platform.; DatasheetVersion: PD-9.655A; PackageReference: TO-251AA; Publisher: Altium Limited; PackageDescription: TO, Thru-Hole, Vertical, Heatsink Mounted; 3 In-Line Leads; Pitch 2.28 mm; ComponentLink1Description: Manufacturer Link; ComponentLink1URL: http://www.irf.com/; ComponentLink2Description: Datasheet; ComponentLink2URL: http://www.irf.com/product-info/datasheets/data/irfr9024.pdf
R1-R31 R34 R67 R76 R89 R94 R101 R104-R113 R115 R116 R120 R135 = R-1206: SMD 1206 0.125W 5% 200V; Price: 0.045
  R1 R2 R8 R13 R67 R76 R89 R94 R104-R112 R120: Value: 47k
  R3 R18 R19 R34 R101 R115 R135: Value: 15k
  R4-R7 R9-R12 R14-R17 R20-R31 R113: Value: 6.8k
  R116: Value: 1k
R32 R33 R35-R66 R68-R75 R77-R88 R90-R93 R95-R100 R102 R103 R114 R117-R119 R121-R134 R136-R200 = R-0805: SMD 0805 0.1W 5% 150V; Price: 0.017
  R32 R33 R35-R66 R68-R75 R77-R88 R90-R93 R95-R100 R117 R118 R121 R122 R124-R133 R138-R200: Value: 4.7k
  R102 R103 R136 R137: Value: 10
  R114: Value: 39k
  R119 R134: Value: 470
  R123: Value: 4.7M
SB1-SB4 = Buton TS-06: Price: 0.15
U1-U13 = 74HC595: 8-Bit Serial-Input/Serial-or-Parallel-Output Shift Register with Latched 3-State Outputs; Published: 17-Jul-2002; LatestRevisionDate: 06-Jun-2005; LatestRevisionNote: Stylized 3D Model Added; DatasheetVersion: 1989; PackageReference: 620-09; Publisher: Altium Limited; PackageDescription: DIP; 16 Leads; Row Spacing 7.62 mm; Pitch 2.54 mm; Code_JEDEC: MS-001-BB; ComponentLink1Description: Manufacturer Link; ComponentLink1URL: http://www.onsemi.com/site/products/parametrics/0,4446,557,00.html
U14 = IR2153S: Self-Oscillating Half-Bridge Driver; Published: 8-Jun-2000; LatestRevisionDate: 13-Apr-2006; LatestRevisionNote: IPC-7351 Footprint Added.; DatasheetVersion: PD60062J; PackageVersion: Feb-2001; PackageReference: SO-8; Publisher: Altium Limited; PackageDescription: 8-Pin Plastic Small Outline Integrated Circuit 1.27 mm Pitch; Code_JEDEC: MS-012-AA; Code_IPC: SOIC127P600-8; ComponentLink1Description: Manufacturer Link; ComponentLink1URL: http://www.irf.com/; ComponentLink2Description: Datasheet; ComponentLink2URL: http://www.irf.com/product-info/datasheets/data/ir2153.pdf
U16 = MC74HC14AD: Hex Schmitt Trigger Inverter; Published: 17-Jul-2002; LatestRevisionDate: 13-Apr-2006; LatestRevisionNote: IPC-7351 Footprint Added.; DatasheetVersion: 1989; PackageVersion: 1991; PackageReference: 751A-02; Publisher: Altium Limited; PackageDescription: 14-Pin Small Outline Integrated Circuit 1.27 mm Pitch; Code_IPC: SOIC127P600-14; ComponentLink1Description: Manufacturer Link; ComponentLink1URL: http://www.onsemi.com/site/products/parametrics/0,4446,247,00.html; ComponentLink2Description: Ibis Model; ComponentLink2URL: http://www.onsemi.com/pub/Collateral/MC54HC14AJ.IBS
U18 = STM32F103C8T6TR: ARM Cortex-M3 32-bit MCU, 64 KB Flash, 20 KB Internal RAM, 37 I/Os, 48-pin LQFP, -40 to 85 degC, Tape and Reel; A/D Converter: 2x12-bit (10 Channel); FLASH Size (Prog) (kB): 64; I/Os (High Current): 37; Internal RAM Size (kB): 20; Operating Frequency(F) (Processor speed) (MHz): 72; Supply Voltage(Vcc) min (V): 2; DatasheetVersion: Rev. 16; PackageVersion: Rev. 6, 06/2013; PackageReference: LQFP48; PackageDescription: 48-Pin Low Profile Quad Flat Package, 7 x 7 mm Body, 0.5 mm Pitch; Supplier 1: Digi-Key; Supplier Part Number 1: STM32F103C8T6TR-ND; Supplier 2: Mouser; Supplier Part Number 2: 511-STM32F103C8T6TR; Core: ARM Cortex-M3; Packing: Tape and Reel; Mounting Technology: Surface Mount; PartNumber: STM32F103C8T6TR; ComponentLink1Description: Manufacturer URL; ComponentLink1URL: http://www.st.com/web/en/home.html; ComponentLink2Description: Datasheet; ComponentLink2URL: http://www.st.com/st-web-ui/static/active/en/resource/technical/document/datasheet/CD00161566.pdf; ComponentLink3Description: Package Specification; ComponentLink3URL: http://www.st.com/st-web-ui/static/active/en/resource/technical/document/datasheet/DM00058181.pdf
VD8-VD10 = LED 3x1.4mm Duris E3: 30mA 1.94-2.8cd (20ma)
VD11 VD12 = Led 0805 KP-2012SGC: Green 565nm 15mcd; Price: 0.09
ZQ1 = Q: Typ: Qvarz 14.7456 HC49S; Price: 0.45
J2 = H-1x4: Price: 0.04
VL4 VL7 = H-2x4: Price: 0.08